# Altium schematic sheet regulation.SchDoc
size A; SheetNumber: 1; SheetTotal: 1
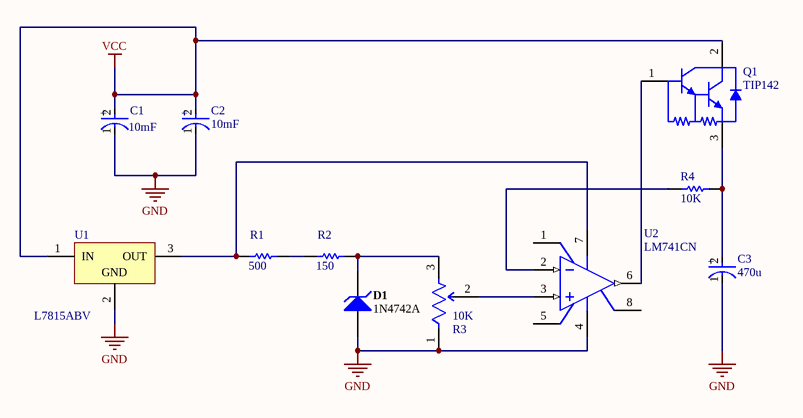
[diagram p0: regulation.SchDoc]

## Parts
C1  10mF  [FP-RAD-TH-D_12_5_0_5-L_20-MFG]
C2  10mF  [FP-RAD-TH-D_12_5_0_5-L_20-MFG]
C3  470u  [FP-RAD-TH-D_16_0_5-L_15_1-MFG]
D1  1N4742A  [FAIR-DO-41-2_V]
Q1  TIP142  [ONSC-SOT-93_TO-218-3-340D-02]
R1  500  [RESA60-630X240]
R2  150  [RESA60-630X240]
R3  10K  [FP-3223W-1-104-MFG]
R4  10K  [RESA60-630X240]
U1  L7815ABV  [TO220]
U2  LM741CN  [N08E]

## Nets
GND: C1.1(C) C2.1(C) C3.1(C) D1.1(A) R3.1(CCW) U1.2(GND) U2.4(V-)
VCC: C1.2(A) C2.2(A) Q1.2(C) U1.1(IN)
NetC3_2: C3.2(A) Q1.3(E) R4.2
NetD1_2: D1.2(K) R2.2 R3.3(CW)
NetQ1_1: Q1.1(B) U2.6(OUT)
NetR1_1: R1.1 U1.3(OUT) U2.7(V+)
NetR1_2: R1.2 R2.1
NetR3_2: R3.2(WIPER) U2.3(IN+)
NetR4_1: R4.1 U2.2(IN-)

Not connected (* = marked no-connect by the designer): U2 1(OFS_NULL) 5(OFS_NULL) 8(NC)

## Notes on the sheet
- (in symbol CMP-05427-000770-1) +
- (in symbol CMP-05427-001016-1) +

## Library data of the parts
C1 C2 = CMP-05427-001016-1: Aluminum Electrolytic Capacitors (Radial Lead Type) 1000uF ±20% 25V; Dissipation Factor: 0.22%; Life (Hours): 10000Hour; Ripple Current: 498mA; Lead/Base Style: Straight; Lead Diameter: 0.6mm; Leakage Current: 250uA; Capacitance: 1mF; Package Quantity: 200; Number of Pins: 2; Packaging: Bulk; Diameter: 12.5mm; Height - Seated (Max): 0.787inch; Voltage Rating (DC): 25V; Mount: Through Hole; Tolerance: 20%; Radiation Hardening: No; Voltage Rating: 25V; Height: 20mm; Construction: RADIAL; Min Operating Temperature: -40°C; Max Operating Temperature: 105°C; Series: EB; Length: 20mm; RoHS Compliant: Yes; Lead Free: Lead Free; REACH SVHC: No SVHC; Case/Package: Radial; Voltage: 25V; Termination: Radial; Lead Pitch: 5mm
C3 = CMP-05427-000770-1: Aluminum Electrolytic Capacitors (Radial Lead Type) AEC-Q200 Qualified 330uF ±20% 50V; Lead Diameter: 0.8mm; Life (Hours): 2000Hour; Ripple Current: 1.45A; Case/Package: Radial; Voltage Rating (DC): 50V; RoHS Compliant: Yes; Length: 15mm; Tolerance: 20%; Series: TA; Diameter: 16mm; Voltage Rating: 50V; Capacitance: 330uF; Packaging: Bulk; REACH SVHC: No SVHC; Max Operating Temperature: 125°C; Termination: Radial; Package Quantity: 100; Radiation Hardening: No; Height: 15mm; Lead Pitch: 7.5mm; Number of Pins: 2; Mount: Through Hole; Min Operating Temperature: -40°C
D1 = CMP-0892-00001-1: Zener Diode, 12V, 1W, 5%, -65 to 200 degC, 2-Pin DO-41, Body 2.72 x 5.2 mm, RoHS; Manufacturer: Fairchild Semiconductor; PD (W): 1; VZ (Min.) (V): 11.4; VZ (Max.) (V): 12.6; ZZ (Max) (ohm): 8; IR (uA): 5; Test Current IZ (mA): 21; PartNumber: 1N4742A; PackageVersion: Rev. 2; DatasheetVersion: Rev. H3; Mounting Technology: Through Hole; Tolerance: 5%; PackageDescription: 2-Pin Axial leaded, Body 2.72 x 5.2 mm, Lead Spread 25.4 mm; ComponentLink1Description: Manufacturer URL; ComponentLink3Description: Package Specification; ComponentLink2Description: Datasheet; ComponentLink2URL: http://www.fairchildsemi.com/ds/1N/1N4744A.pdf; PackageReference: DO-41-2; RoHS: TRUE; Operating and Storage Temperature Range: -65 to 200 degC; ComponentLink3URL: http://www.fairchildsemi.com/dwg/DO/DO41A.pdf; ComponentLink1URL: http://www.fairchildsemi.com/
Q1 = CMP-1047-00065-1: Darlington Complementary Silicon Power Transistor, 3-Pin SOT-93, Tube; Manufacturer: On Semiconductor; IC Continuous (A): 10; Polarity: NPN; PackageDescription: 3-Pin Flange Mount, Vertical Straight Lead, Body 14.95 x 4.8 mm, Pitch 5.475 mm; ComponentLink1Description: Manufacturer URL; PackageVersion: Rev. E; ComponentLink2Description: Datasheet; ComponentLink3Description: Package Specification; ComponentLink3URL: http://www.onsemi.com/pub_link/Collateral/TIP33C-D.PDF; Packing: Tube; PartNumber: TIP142; RoHS: FALSE; ComponentLink1URL: http://www.onsemi.com/; Mounting Technology: Through Hole; ComponentLink2URL: http://www.onsemi.cn/pub_link/Collateral/TIP140-D.PDF; DatasheetVersion: Rev. 6; PackageReference: SOT-93_TO-218-3-340D-02
R1 R2 = CMP-1659-00075-1: Axial Resistor, 1 KOhm, +/- 1%, 250 mW, -55 to 155 degC, 2-Pin THD, RoHS, Bulk; Voltage Rating: 250 V; Resistance: 10 kohm; Power Rating: 250 mW; ComponentLink2Description: Datasheet; RoHSCompliant: true; PackageReference: MFR-25; Case\Package: Axial; Max Operating Temperature: 155 degC; DatasheetVersion: Apr-13; Tolerance: 1%; ComponentLink1URL: http://www.yageo.com/; Length: 0.248 inch; ComponentLink2URL: http://www.yageo.com/documents/recent/Yageo%20LR_MFR_2013.pdf; Packaging: Bulk; Package Quantity: 200; PackageDescription: 2-Pin Axial Lead, Dia 2.4 mm, Body Length 6.3 mm; Min Operating Temperature: -55 degC; ComponentLink1Description: Manufacturer URL
R3 = CMP-07234-000044-1: TRIMMER 100K OHM 0.125W J LEAD; Number of Turns: 11; Resistance: 100kR; Max Power Dissipation: 125mW; Tolerance: 20%; Max Supply Voltage: 300V; Temperature Coefficient: 100ppm/°C; Resistor Type: Cermet; Series: Trimpot® 3223 - Sealed; Min Operating Temperature: -65°C; Packaging: Rail/Tube; Height: 0.164inch; Max Operating Temperature: 150°C; Technology: CERMET; Termination: SMD/SMT; Mount: Surface Mount; Power Rating: 125mW; Taper: Linear; Package Quantity: 200
R4 = CMP-1659-00074-2: Axial Resistor, 10 KOhm, +/- 1%, 0.25 W, -55 to 155 degC, 2-Pin THD, RoHS, Bulk; Manufacturer: Yageo; Temperature Coefficient: 100ppm\/degreesC; Voltage Rating: 250V; Voltage Rating (DC): 200V; Resistance: 10KOhm; Max Power Dissipation: 250mW; Datasheet URL: http://www.yageo.com/documents/recent/Yageo%20LR_MFR_2013.pdf; Packaging: Bulk; RoHSCompliant: True; Mount: ThroughHole; Package Reference: MFR-25; Termination: Axial; Composition: MetalFilm; Number of Terminations: 2; Package Quantity: 200; Mounting Technology: ThroughHole; Length: 0.248inch; Max Operating Temperature: 155degC; Min Operating Temperature: -55degC; Datasheet Version: 04/2013; Lead Free: LeadFree; Manufacturer URL: http://www.yageo.com/; Tolerance: 1%; Power Rating: 250mW; Package Description: 2-Pin Axial Lead, Dia 2.4 mm, Body Length 6.3 mm; Military Standard: Not; Case\/Package: Axial
U1 = CMP-0244-00468-1: Positive Voltage Regulator, 15V, 3-Pin TO-220; ComponentLink1URL: http://www.st.com; ComponentLink3Description: Package Specification; ComponentLink3URL: http://www.st.com/internet/com/TECHNICAL_RESOURCES/TECHNICAL_LITERATURE/PACKAGE_INFORMATION/CD00004649.pdf; DatasheetVersion: 16/11/2011; ComponentLink2URL: http://www.st.com/internet/com/TECHNICAL_RESOURCES/TECHNICAL_LITERATURE/DATASHEET/CD00000444.pdf; PackageDescription: TO, Thru-Hole, Vertical, Heatsink Mounted; 3 In-Line Leads; Pitch 2.54 mm; ComponentLink1Description: Manufacturer URL; PackageVersion: ver3.0; ComponentLink2Description: Datasheet; PackageReference: TO220
U2 = CMP-0055-00155-2: Operational Amplifier, 8-pin MDIP; Manufacturer: National Semiconductor; PowerWise: N; CompType: Amplifiers; PackageTopMarking: NSUZXYTTE#*LM*741CN; PackageVersion: revG, May-2006; Code_JEDEC: MS-001-BA; RoHS: N; ComponentLink2URL: http://www.national.com/pf/LM/LM741.html; ComponentLink3Description: N08E Package Page; PackageReference: N08E; ComponentLink1Description: LM741 Datasheet; PinCount: 8; ComponentLink1URL: http://www.national.com/ds/LM/LM741.pdf; ComponentLink2Description: LM741 Web Page; DatasheetVersion: Aug-2000; PackageDescription: MDIP, .365 x .250 x .130in, 8 Lead, .100in Pitch; RevisionNote: Component URLs added; ComponentLink3URL: http://www.national.com/packaging/folders/n08e.html